# EAGLE schematic bekono2 (EAGLE 7.2.0)
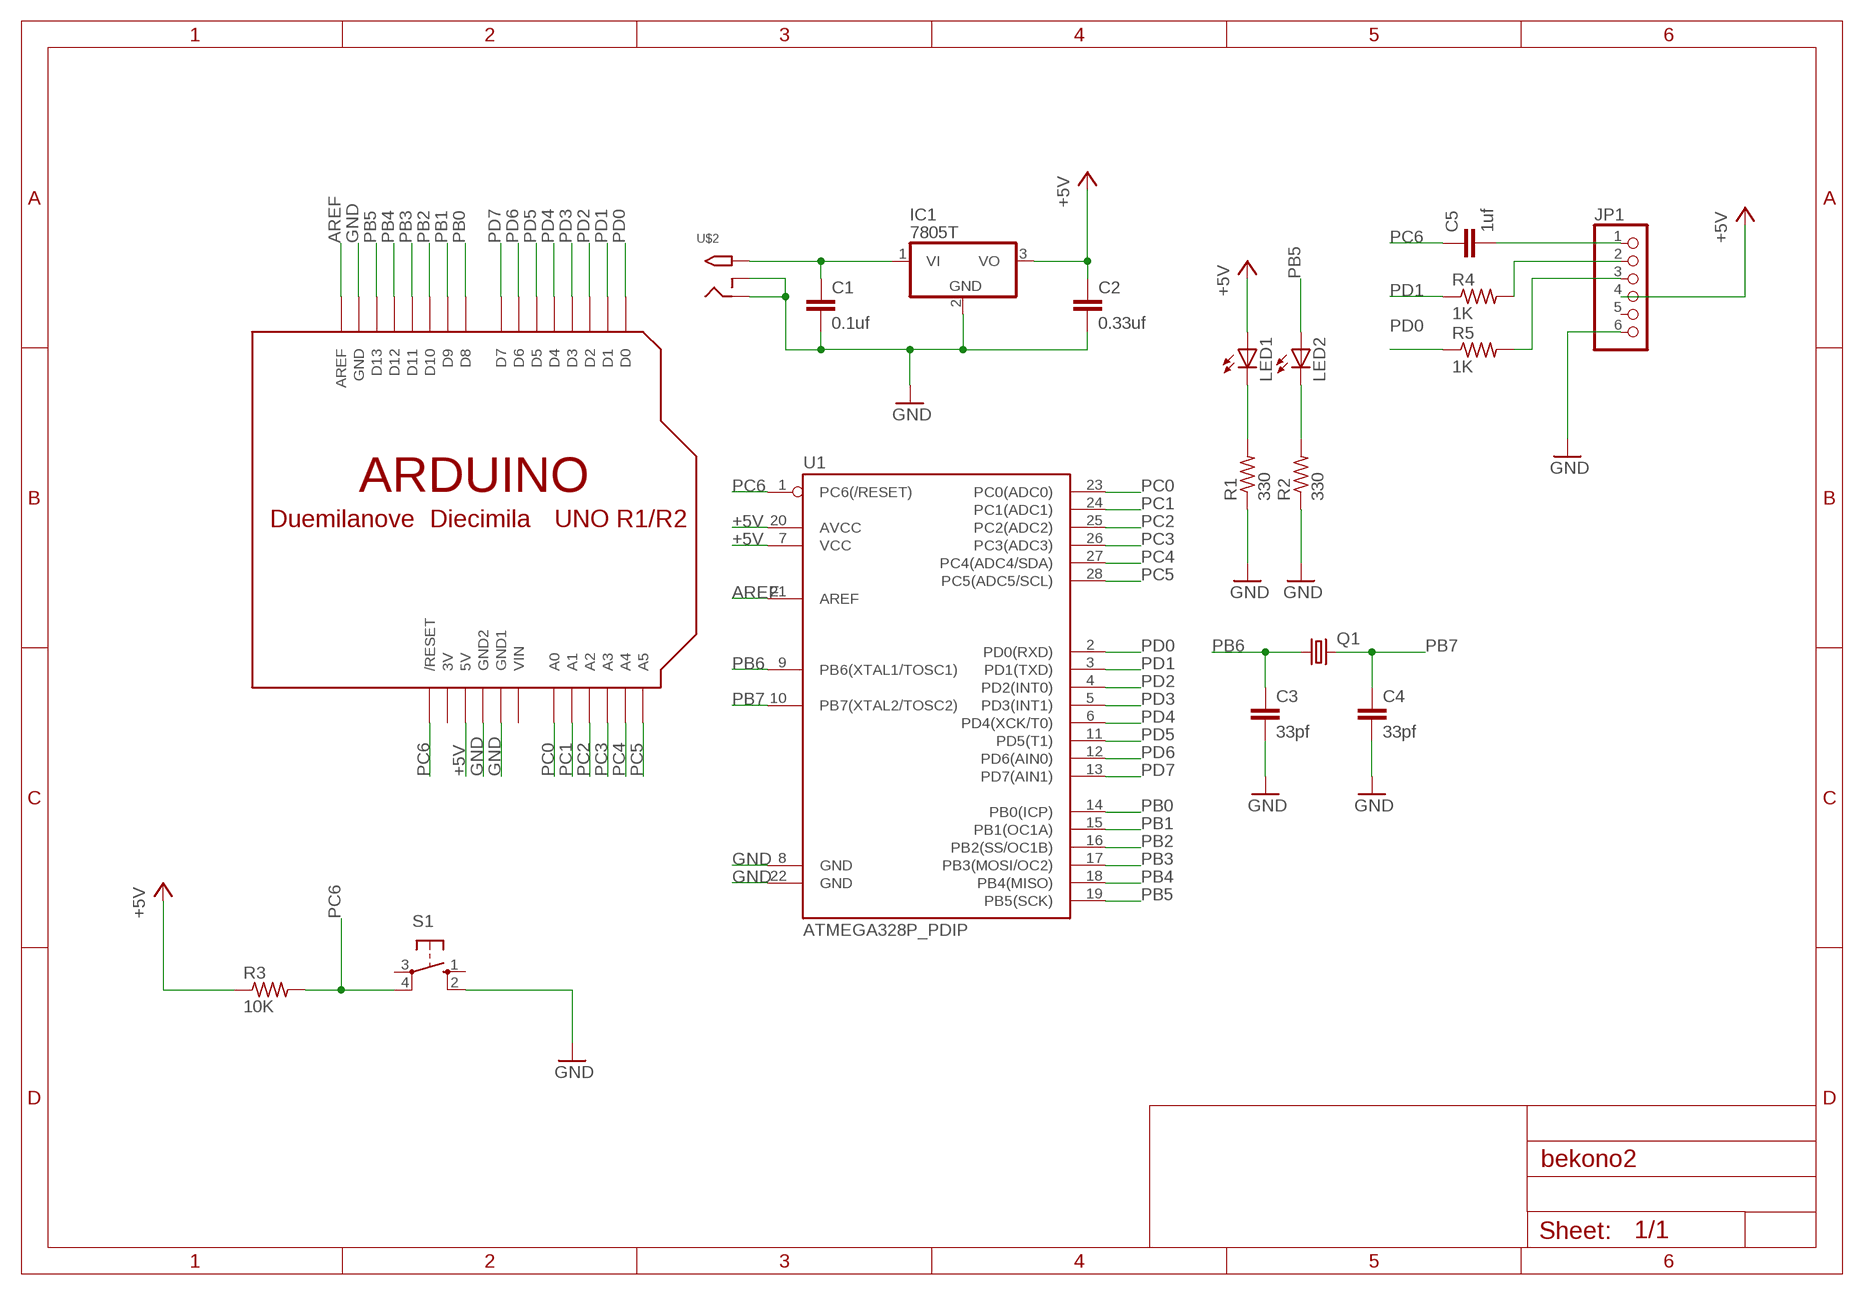
[diagram p0: schematic, sheet 1]

## Parts
C1  0.1uf  C2.5/2  [C2.5-2]
C2  0.33uf  C2.5/2  [C2.5-2]
C3  33pf  C2.5/2  [C2.5-2]
C4  33pf  C2.5/2  [C2.5-2]
C5  1uf  C2.5/2  [C2.5-2]
IC1  7805T  [TO220H]
JP1  PINHD-1X6CB  [1X06-CLEANBIG]
LED1  LED5MM  [LED5MM]
LED2  LED5MM  [LED5MM]
Q1  CRYSTALHC49S  [HC49/S]
R1  330  FLIPFLOP-RES  [0805-THM]
R2  330  FLIPFLOP-RES  [0805-THM]
R3  10K  FLIPFLOP-RES  [0805-THM]
R4  1K  FLIPFLOP-RES  [0805-THM]
R5  1K  FLIPFLOP-RES  [0805-THM]
S1  10-XX  [B3F-10XX]
U1  ATMEGA328P_PDIP  [DIL28-3]
U$1  ARDUINO-BPLACE  [ARDUINO-BPLACE]
U$2  2.1MMJACKTHM  [PJ-102A]

## Nets
+5V: C2.1 IC1.3(VO) JP1.4 LED1.A R3.1 U1.7(VCC) U1.20(AVCC) U$1.5V
AREF: U1.21(AREF) U$1.AREF
GND: C1.2 C2.2 C3.2 C4.2 IC1.2(GND) JP1.6 R1.1 R2.1 S1.2(S1) U1.8(GND) U1.22(GND) U$1.GND U$1.GND1 U$1.GND2 U$2.RING U$2.RING_SW
N$1: C1.1 IC1.1(VI) U$2.TIP
N$2: LED1.K(C) R1.2
N$3: LED2.K(C) R2.2
N$4: C5.2 JP1.1
N$5: JP1.2 R4.2
N$7: JP1.3 R5.2
PB0: U1.14(PB0(ICP)) U$1.D8
PB1: U1.15(PB1(OC1A)) U$1.D9
PB2: U1.16(PB2(SS/OC1B)) U$1.D10
PB3: U1.17(PB3(MOSI/OC2)) U$1.D11
PB4: U1.18(PB4(MISO)) U$1.D12
PB5: LED2.A U1.19(PB5(SCK)) U$1.D13
PB6: C3.1 Q1.1 U1.9(PB6(XTAL1/TOSC1))
PB7: C4.1 Q1.2 U1.10(PB7(XTAL2/TOSC2))
PC0: U1.23(PC0(ADC0)) U$1.A0
PC1: U1.24(PC1(ADC1)) U$1.A1
PC2: U1.25(PC2(ADC2)) U$1.A2
PC3: U1.26(PC3(ADC3)) U$1.A3
PC4: U1.27(PC4(ADC4/SDA)) U$1.A4
PC5: U1.28(PC5(ADC5/SCL)) U$1.A5
PC6: C5.1 R3.2 S1.4(P1) U1.1(PC6(/RESET)) U$1.RESET(/RESET)
PD0: R5.1 U1.2(PD0(RXD)) U$1.D0
PD1: R4.1 U1.3(PD1(TXD)) U$1.D1
PD2: U1.4(PD2(INT0)) U$1.D2
PD3: U1.5(PD3(INT1)) U$1.D3
PD4: U1.6(PD4(XCK/T0)) U$1.D4
PD5: U1.11(PD5(T1)) U$1.D5
PD6: U1.12(PD6(AIN0)) U$1.D6
PD7: U1.13(PD7(AIN1)) U$1.D7
Unconnected: JP1.5 S1.1(S) S1.3(P)

## Power pins joined to a net without a drawn wire
3V: U$1.3V
VIN: U$1.VIN

## Library data of the parts
C1-C5 = capacitor-wima:C: CAPACITOR naming: grid - package width
IC1 = adafruit:78*: Positive VOLTAGE REGULATOR Added bigger pads to the TO-92 package
JP1 = adafruit:PINHD-1X6: PIN HEADER
LED1 LED2 = adafruit:LED: LED OSRAM: - CHIPLED LG R971, LG N971, LY N971, LG Q971, LY Q971, LO R971, LY R971 LH N974, LH R974 LS Q976, LO Q976, LY Q976 LO Q996 - Hyper CHIPLED LW Q18S LB Q993, LB Q99A, LB R99A - SideLED LS A670, LO A670, LY A670, LG A670, LP A670 LB A673, LV A673, LT A673, LW A673 LH A674 LY A675 LS A676, LA A676, LO A676, LY A676, LW A676 LS A679, LY A679, LG A679 - Hyper Micro SIDELED® LS Y876, LA Y876, LO Y876, LY Y876 LT Y87S - SmartLED LW L88C, LW L88S LB L89C, LB L89S, LG L890 LS L89K, LO L89K, LY L89K LS L896, LA L896, LO L896, LY L896 - TOPLED LS T670, LO T670, LY T670, LG T670, LP T670 LSG T670, LSP T670, LSY T670, LOP T670, LYG T670 LG T671, LOG T671, LSG T671 LB T673, LV T673, LT T673, LW T673 LH T674 LS T676, LA T676, LO T676, LY T676, LB T676, LH T676, LSB T676, LW T676 LB T67C, LV T67C, LT T67C, LS T67K, LO T67K, LY T67K, LW E67C LS E67B, LA E67B, LO E67B, LY E67B, LB E67C, LV E67C, LT E67C LW T67C LS T679, LY T679, LG T679 LS T770, LO T770, LY T770, LG T770, LP T770 LB T773, LV T773, LT T773, LW T773 LH T774 LS E675, LA E675, LY E675, LS T675 LS T776, LA T776, LO T776, LY T776, LB T776 LHGB T686 LT T68C, LB T68C - Hyper Mini TOPLED® LB M676 - Mini TOPLED Santana® LG M470 LS M47K, LO M47K, LY M47K Source: http://www.osram.convergy.de/
Q1 = adafruit:CRYSTAL: CRYSTAL; OC_FARNELL: 1667008; OC_NEWARK: unknown
R1-R5 = adafruit:FLIPFLOP-RES: Flip Flop resistor An 0805 resistor inside a standard 1/4W 5% resistor. Makes for easy mods
S1 = switch-omron:10-XX: OMRON SWITCH; MPN: B3F-1000; OC_FARNELL: 176432; OC_NEWARK: 36M3542
U1 = SparkFun-DigitalIC:ATMEGA328P_PDIP: uC used in the Arduino 32kb flash, 1k EEPROM, 2k SRAM This is the through-hole version of this chip.
U$1 = adafruit:ARDUINO: Arduino Diecimila/Duemilanove Make a shield with ease, this package has all the named pins as well as the two mounting drill holes and an outline of the USB and DC power connector. The outline is on the DIMENSION layer, so if your board house uses it they will cut the outline to match. http://www.ladyada.net/library/pcb/eaglelibrary.html
U$2 = adafruit:2.1MMJACK: 2.1mm x 5.5mm THM DC jack with internal switch. Digikey part #PJ-102A, 4UCON part #05537 2.1mm x 5.5mm SMT DC jack with internal switch. Digikey part #PJ-002A-SMT, 4UCON part #03267 By microbuilder.eu & adafruit.com